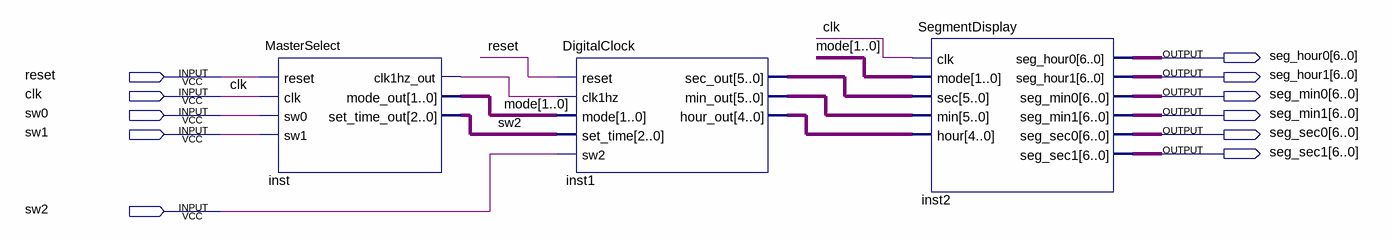
[diagram p0: schematic sheet]
// Quartus schematic DigitalWatch.bdf as structural Verilog: 3 symbols, 11 pins
module DigitalWatch (
  input  reset,
  input  clk,
  input  sw0,
  input  sw1,
  input  sw2,
  output [6:0] seg_hour0,
  output [6:0] seg_hour1,
  output [6:0] seg_min0,
  output [6:0] seg_min1,
  output [6:0] seg_sec0,
  output [6:0] seg_sec1
);

  wire inst_clk1hz_out;
  wire [1:0] mode;
  wire [2:0] inst_set_time_out;
  wire [4:0] inst1_hour_out;
  wire [5:0] inst1_min_out, inst1_sec_out;

  MasterSelect inst (
    .reset(reset), .clk(clk), .sw0(sw0), .sw1(sw1), .clk1hz_out(inst_clk1hz_out), .mode_out(mode),
    .set_time_out(inst_set_time_out));
  DigitalClock inst1 (
    .reset(reset), .clk1hz(inst_clk1hz_out), .mode(mode), .set_time(inst_set_time_out), .sw2(sw2),
    .sec_out(inst1_sec_out), .min_out(inst1_min_out), .hour_out(inst1_hour_out));
  SegmentDisplay inst2 (
    .clk(clk), .mode(mode), .sec(inst1_sec_out), .min(inst1_min_out), .hour(inst1_hour_out),
    .seg_hour0(seg_hour0), .seg_hour1(seg_hour1), .seg_min0(seg_min0), .seg_min1(seg_min1),
    .seg_sec0(seg_sec0), .seg_sec1(seg_sec1));
endmodule
